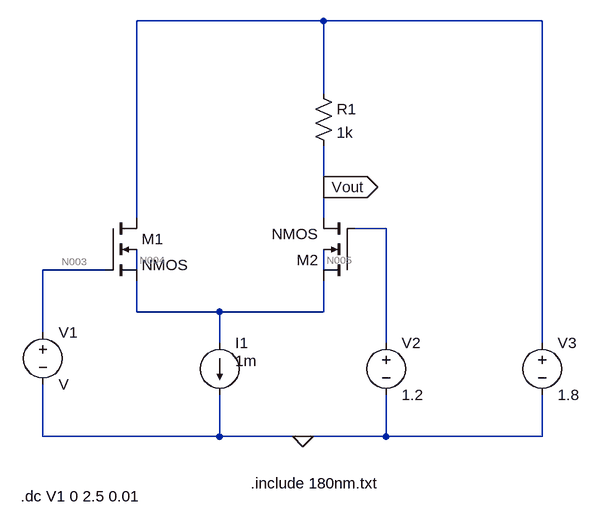
[diagram p0: schematic Draft9.asc]
Draft9.asc, the LTspice schematic file:
Version 4
SHEET 1 880 680
WIRE 432 -368 144 -368
WIRE 768 -368 432 -368
WIRE 432 -256 432 -368
WIRE 432 -112 432 -176
WIRE 144 -64 144 -368
WIRE 432 -64 432 -112
WIRE 528 -48 480 -48
WIRE 96 16 0 16
WIRE 144 16 144 -16
WIRE 432 16 432 -16
WIRE 144 80 144 32
WIRE 272 80 144 80
WIRE 432 80 432 32
WIRE 432 80 272 80
WIRE 0 112 0 16
WIRE 272 128 272 80
WIRE 528 128 528 -48
WIRE 768 128 768 -368
WIRE 0 272 0 192
WIRE 272 272 272 208
WIRE 272 272 0 272
WIRE 400 272 272 272
WIRE 528 272 528 208
WIRE 528 272 400 272
WIRE 768 272 768 208
WIRE 768 272 528 272
FLAG 400 272 0
FLAG 432 -112 Vout
IOPIN 432 -112 Out
SYMBOL voltage 0 96 R0
SYMATTR InstName V1
SYMBOL voltage 528 112 R0
WINDOW 123 0 0 Left 2
WINDOW 39 0 0 Left 2
SYMATTR InstName V2
SYMATTR Value 1.2
SYMBOL voltage 768 112 R0
WINDOW 123 0 0 Left 2
WINDOW 39 0 0 Left 2
SYMATTR InstName V3
SYMATTR Value 1.8
SYMBOL nmos4 96 -64 R0
SYMATTR InstName M1
SYMATTR Value2 l=.18u w=10u
SYMBOL nmos4 480 32 R180
SYMATTR InstName M2
SYMATTR Value2 l=.18u w=10u
SYMBOL current 272 128 R0
WINDOW 3 24 28 Left 2
WINDOW 123 0 0 Left 2
WINDOW 39 0 0 Left 2
SYMATTR InstName I1
SYMATTR Value 1m
SYMBOL res 416 -272 R0
SYMATTR InstName R1
SYMATTR Value 1k
TEXT 320 344 Left 2 !.include 180nm.txt
TEXT -34 364 Left 2 !.dc V1 0 2.5 0.01

The netlist it stands for:
* Draft9.asc
V1 N003 0 V
V2 N002 0 1.2
V3 N001 0 1.8
M1 N001 N003 N006 N004 NMOS l=.18u w=10u
M2 N006 N002 Vout N005 NMOS l=.18u w=10u
I1 N006 0 1m
R1 N001 Vout 1k
.model NMOS NMOS
.model PMOS PMOS
.lib standard.mos
.include 180nm.txt
.dc V1 0 2.5 0.01
.backanno
.end

* Results of the author's LTspice run, read from the files saved beside the schematic
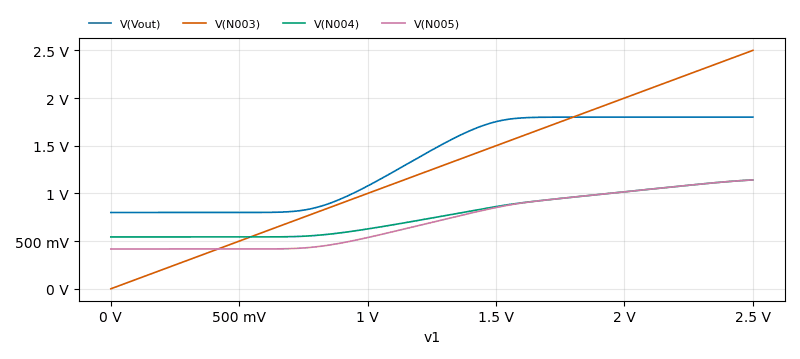
[diagram p1: DC transfer characteristic of Draft9.asc, plotted from the saved traces]
* DC transfer characteristic, 1 run:
*   V(Vout): 800 mV at v1=0 V, 1.8 V at v1=2.5 V, min 800 mV, max 1.8 V
*   V(N003): 0 V at v1=0 V, 2.5 V at v1=2.5 V, min 0 V, max 2.5 V
*   V(N004): 543.6 mV at v1=0 V, 1.142 V at v1=2.5 V, min 543.6 mV, max 1.142 V
*   V(N005): 417.3 mV at v1=0 V, 1.142 V at v1=2.5 V, min 417.3 mV, max 1.142 V